# EAGLE design SNESRemote (EAGLE 7.7.0)
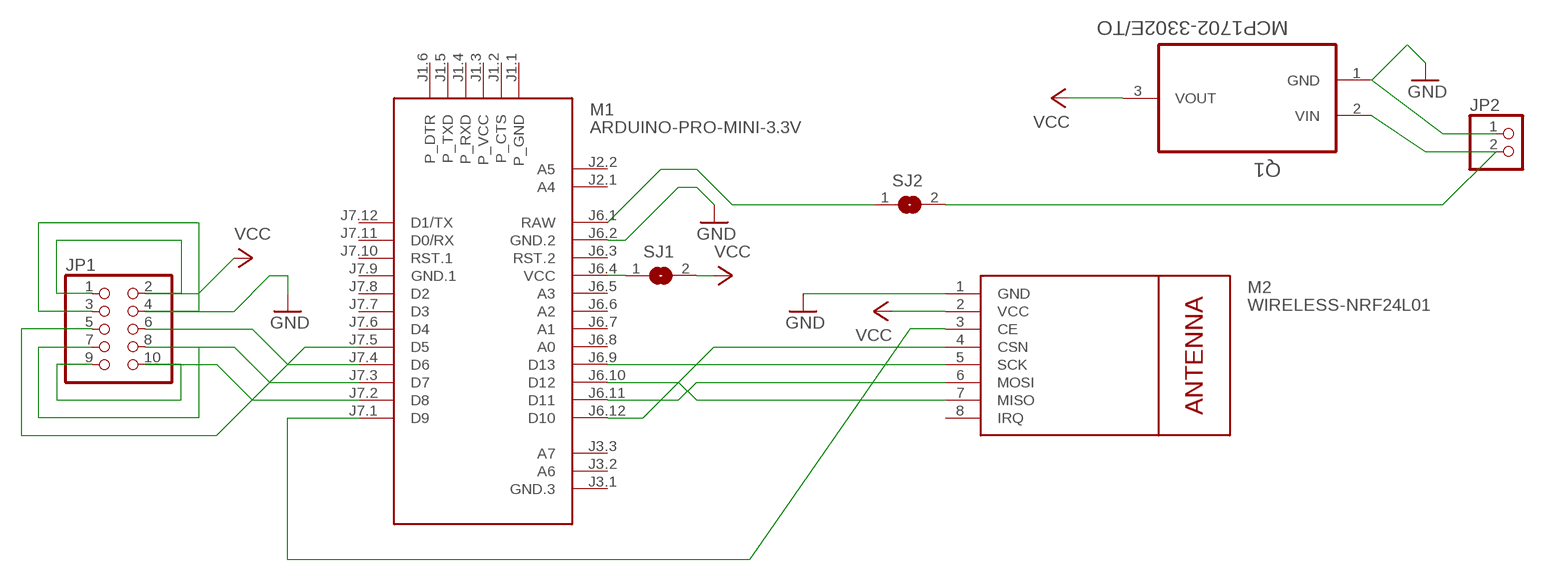
[diagram p0: schematic, sheet 1]

## Parts
JP1  PINHD-2X5  [2X05]
JP2  PINHD-1X2  [1X02]
M1  ARDUINO-PRO-MINI-3.3V  [ARDUINO-PRO-MINI]
M2  WIRELESS-NRF24L01  [WIRELESS-NRF24L01]
Q1  MCP1702-3302E/TO  [TO127P254X533-3]
SJ1  SJ  [SJ]
SJ2  SJ  [SJ]

## Nets
GND: JP1.3 JP1.4 JP2.1 M1.J6.2(GND.2) M2.1(GND) Q1.1(GND)
N$1: M1.J6.9(D13) M2.5(SCK)
N$2: M1.J6.10(D12) M2.7(MISO)
N$3: M1.J6.11(D11) M2.6(MOSI)
N$4: M1.J6.12(D10) M2.4(CSN)
N$5: M1.J7.1(D9) M2.3(CE)
N$6: M1.J6.4(VCC) SJ1.1
N$7: M1.J6.1(RAW) SJ2.1
N$8: JP1.9 JP1.10 M1.J7.2(D8)
N$9: JP1.7 JP1.8 M1.J7.3(D7)
N$10: JP1.6 M1.J7.4(D6)
N$11: JP1.5 M1.J7.5(D5)
N$12: JP2.2 Q1.2(VIN) SJ2.2
VCC: JP1.1 JP1.2 M2.2(VCC) Q1.3(VOUT) SJ1.2
Unconnected: M1.J1.1(P_GND) M1.J1.2(P_CTS) M1.J1.3(P_VCC) M1.J1.4(P_RXD) M1.J1.5(P_TXD) M1.J1.6(P_DTR) M1.J2.1(A4) M1.J2.2(A5) M1.J3.1(GND.3) M1.J3.2(A6) M1.J3.3(A7) M1.J6.3(RST.2) M1.J6.5(A3) M1.J6.6(A2) M1.J6.7(A1) M1.J6.8(A0) M1.J7.6(D4) M1.J7.7(D3) M1.J7.8(D2) M1.J7.10(RST.1) M1.J7.11(D0/RX) M1.J7.12(D1/TX) M2.8(IRQ)

## Power pins joined to a net without a drawn wire
GND.1: M1.J7.9(GND.1)

## Library data of the parts
JP1 = pinhead:PINHD-2X5: PIN HEADER
JP2 = pinhead:PINHD-1X2: PIN HEADER
M1 = diy-modules:ARDUINO-PRO-MINI-*: Arduino Pro Mini
M2 = diy-modules:WIRELESS-NRF24L01: 2.4 GHz Wireless Module based on NRF24L01 chip
Q1 = Microchip_By_element14_Batch_1:MCP1702-3302E/TO: IC, V REG, LDO, 250MA; MPN: MCP1702-3302E/TO; OC_FARNELL: 1331485; OC_NEWARK: 34M7419; PACKAGE: TO-92; SUPPLIER: Microchip
SJ1 SJ2 = jumper:SJ: SMD solder JUMPER

## Board
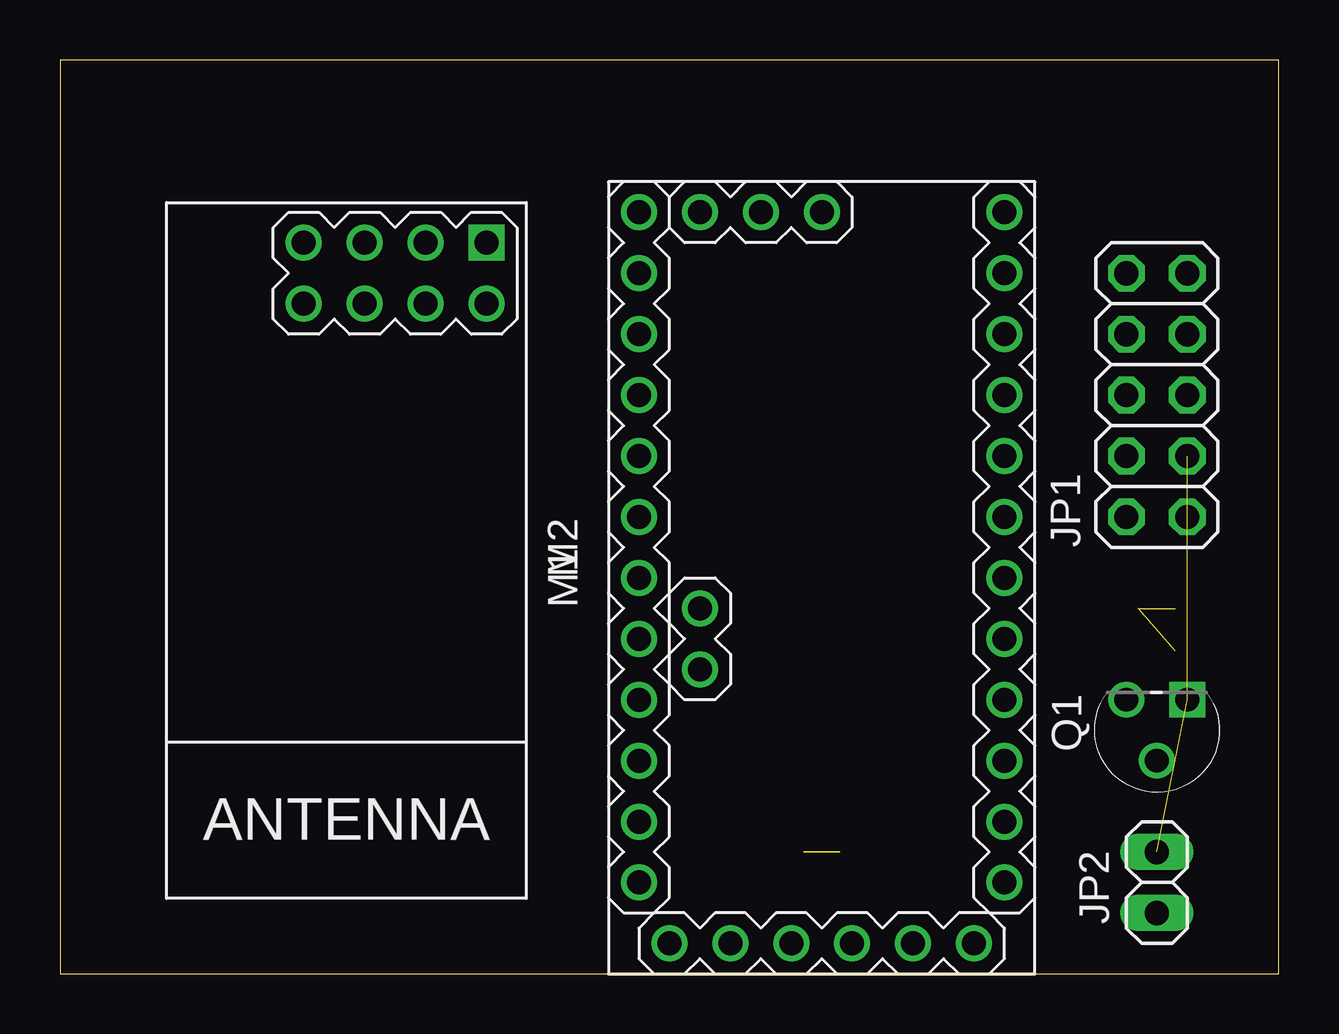
[diagram p1: board, top side]
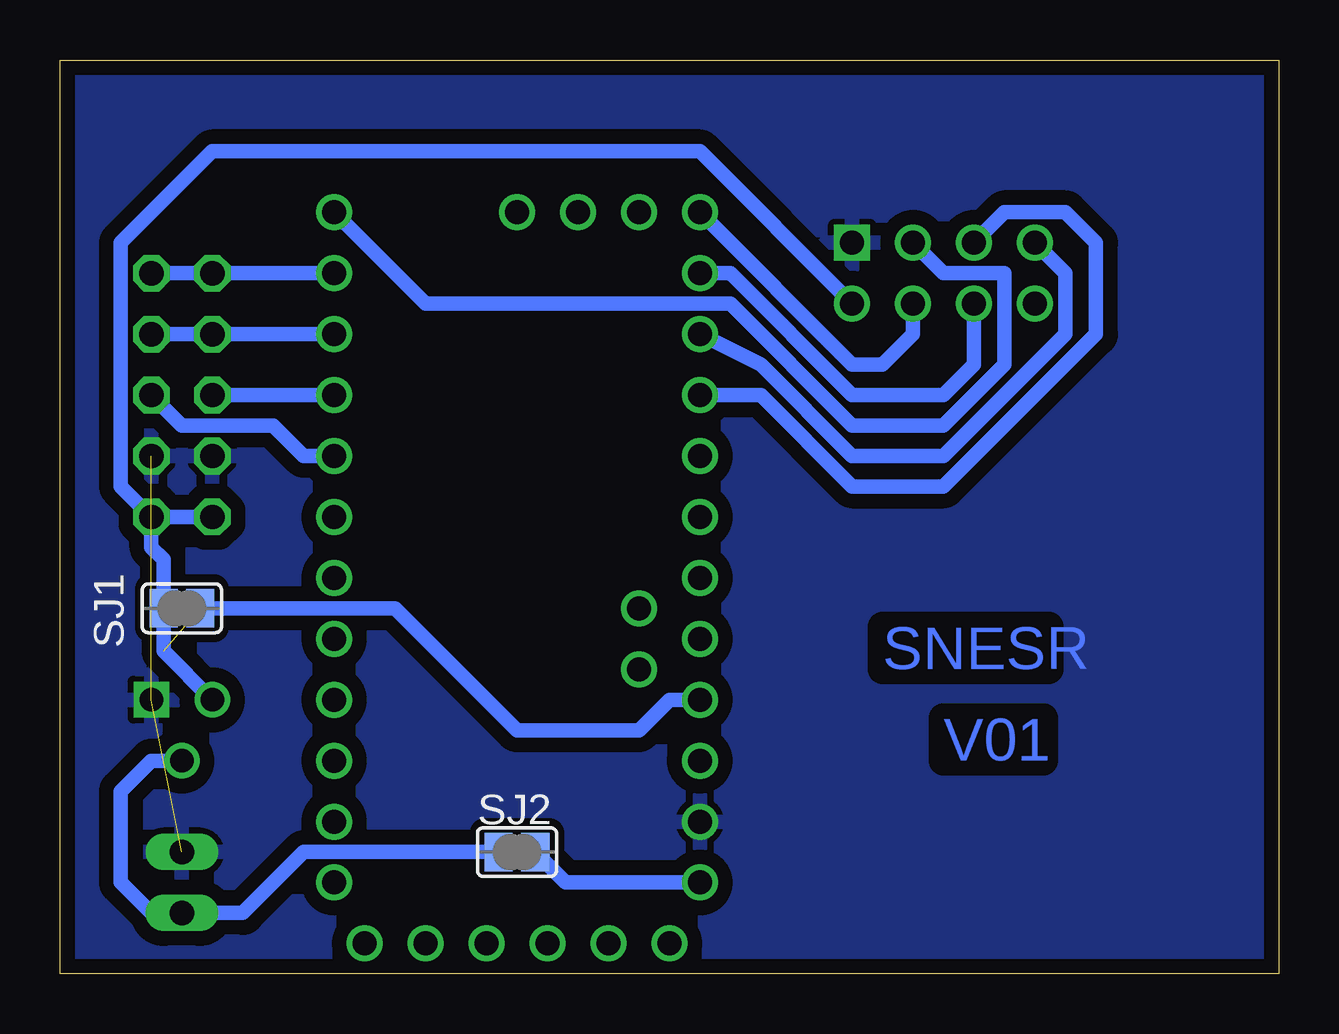
[diagram p2: board, bottom side, seen from below]

Size 50.8 x 38.1 mm. Coordinates in mm from the lower left corner, seen from the top.
Outline: 0,0 50.8,0 50.8,38.1 0,38.1 0,0
Copper layers (1*16): Top 0.0356mm / dielectric 1.5011mm / Bottom 0.0356mm
Design rules "LaenPCBOrder *": minimum track width 6mil, minimum drill 13mil, track to track 8mil, track to pad 8mil, pad to pad 8mil, via to via 8mil, smd to smd 6mil, copper to edge 15mil, drill to drill 6mil, minimum pad ring 7mil, minimum via ring 7mil, stop-mask expansion 3mil, vias tented up to drill 0mil, thermal gap 10mil

### Footprints (pad centres in the part's own frame; a part is rotated, then mirrored left to right if it is on the bottom)
2X05 = drill 1.016 octagon: 1 -5.08,-1.27; 2 -5.08,1.27; 3 -2.54,-1.27; 4 -2.54,1.27; 5 0,-1.27; 6 0,1.27; 7 2.54,-1.27; 8 2.54,1.27; 9 5.08,-1.27; 10 5.08,1.27
1X02 = drill 1.016 long: 1 -1.27,0; 2 1.27,0
ARDUINO-PRO-MINI = drill 1: J1.1 -15.24,6.35; J1.2 -15.24,3.81; J1.3 -15.24,1.27; J1.4 -15.24,-1.27; J1.5 -15.24,-3.81; J1.6 -15.24,-6.35; J2.1 -1.27,5.08; J2.2 -3.81,5.08; J3.1 15.24,0; J3.2 15.24,2.54; J3.3 15.24,5.08; J6.1 -12.7,7.62; J6.2 -10.16,7.62; J6.3 -7.62,7.62; J6.4 -5.08,7.62; J6.5 -2.54,7.62; J6.6 0,7.62; J6.7 2.54,7.62; J6.8 5.08,7.62; J6.9 7.62,7.62; J6.10 10.16,7.62; J6.11 12.7,7.62; J6.12 15.24,7.62; J7.1 15.24,-7.62; J7.2 12.7,-7.62; J7.3 10.16,-7.62; J7.4 7.62,-7.62; J7.5 5.08,-7.62; J7.6 2.54,-7.62; J7.7 0,-7.62; J7.8 -2.54,-7.62; J7.9 -5.08,-7.62; J7.10 -7.62,-7.62; J7.11 -10.16,-7.62; J7.12 -12.7,-7.62
WIRELESS-NRF24L01 = drill 1 square: 1 -12.7,6.35 | drill 1: 2 -10.16,6.35; 3 -12.7,3.81; 4 -10.16,3.81; 5 -12.7,1.27; 6 -10.16,1.27; 7 -12.7,-1.27; 8 -10.16,-1.27
TO127P254X533-3 = drill 0.991 square: 1 -2.54,-2.54 | drill 0.991: 2 -1.27,0; 3 0,-2.54
SJ = smd 1.168 x 1.6: 1 -0.762,0; 2 0.762,0

### Placement (x,y rotation side)
JP1  45.72,24.13 90 top
JP2  45.72,3.81 270 top
M1  31.75,16.51 90 top
M2  11.43,17.78 270 top
Q1  44.45,8.89 180 top
SJ1  45.72,15.24 0 bottom
SJ2  31.75,5.08 0 bottom

### Tracks (layer width: path | path; a pad name or v marks a point on that pad's centre or on a via)
GND  (2 unrouted)
  pour Bottom (isolate 0.61): 0,38.1 50.8,38.1 50.8,0 0,0
N$1
  Bottom 0.61: M1.J6.9 21.59,24.13 17.78,20.32 13.97,20.32 7.62,26.67 7.62,30.48 8.89,31.75 11.43,31.75 M2.5
N$2
  Bottom 0.61: M1.J6.10 21.59,25.4 17.78,21.59 13.97,21.59 8.89,26.67 8.89,29.21 M2.7
N$3
  Bottom 0.61: M1.J6.11 22.86,29.21 17.78,24.13 13.97,24.13 12.7,25.4 M2.6
N$4
  Bottom 0.61: M1.J6.12 17.78,25.4 16.51,25.4 15.24,26.67 M2.4
N$5
  Bottom 0.61: M2.3 13.97,29.21 11.43,29.21 11.43,25.4 13.97,22.86 17.78,22.86 22.86,27.94 35.56,27.94 M1.J7.1
N$6  (1 unrouted)
  Bottom 0.61: M1.J6.4 25.4,11.43 26.67,10.16 31.75,10.16 36.83,15.24 44.96,15.24
N$7  (1 unrouted)
  Bottom 0.61: M1.J6.1 29.72,3.81 30.99,5.08
N$8
  Bottom 0.61: JP1.9 JP1.10 M1.J7.2
N$9
  Bottom 0.61: M1.J7.3 JP1.8 JP1.7
N$10
  Bottom 0.61: JP1.6 M1.J7.4
N$11
  Bottom 0.61: M1.J7.5 40.64,21.59 41.91,22.86 45.72,22.86 JP1.5
N$12  (1 unrouted)
  Bottom 0.406: 46.99,2.54 JP2.2
  Bottom 0.61: Q1.2 46.99,8.89 48.26,7.62 48.26,3.81 46.99,2.54 | 32.51,5.08 40.64,5.08 43.18,2.54 JP2.2
VCC  (1 unrouted)
  Bottom 0.61: JP1.2 JP1.1 | Q1.3 46.48,13.46 46.48,17.27 46.99,17.78 JP1.1 | M2.2 24.13,34.29 44.45,34.29 48.26,30.48 48.26,20.32 JP1.1

### Text on the board
Bottom: SNESR | V01